# Altium schematic sheet TempAdc.SchDoc
size A4; DocumentNumber: 8; SheetNumber: 8; SheetTotal: 15
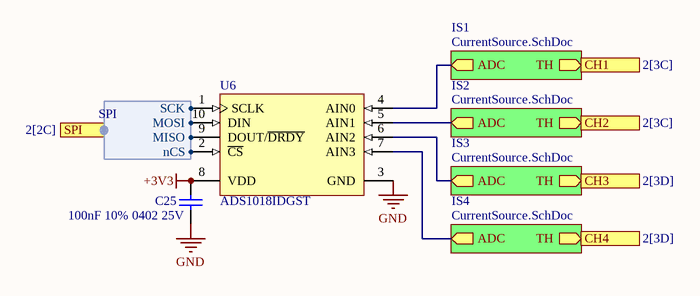
[diagram p0: TempAdc.SchDoc]

## Parts
C25  100nF 10% 0402 25V  [0402N]
U6  ADS1018IDGST  [TI-DGS10_N]

## Sub-sheets
IS1 = CurrentSource.SchDoc: TH (out), ADC (out)
IS2 = CurrentSource.SchDoc: TH (out), ADC (out)
IS3 = CurrentSource.SchDoc: TH (out), ADC (out)
IS4 = CurrentSource.SchDoc: TH (out), ADC (out)

## Ports
CH1 (out, see 2[3C]), CH2 (out, see 2[3C]), CH3 (out, see 2[3D]), CH4 (out, see 2[3D]), SPI (out, harness SPI, see 2[2C])

## Harnesses
SPI: nCS, SCK, MISO, MOSI

## Nets
+3V3: C25.2 U6.8(VDD)
GND: C25.1 U6.3(GND)
CH1: port CH1, sheet IS1/TH
CH2: port CH2, sheet IS2/TH
CH3: port CH3, sheet IS3/TH
CH4: port CH4, sheet IS4/TH
NetU6_1: U6.1(SCLK) ; port SPI.SCK
NetU6_2: U6.2(~{CS}) ; port SPI.nCS
NetU6_4: U6.4(AIN0) ; sheet IS1/ADC
NetU6_5: U6.5(AIN1) ; sheet IS2/ADC
NetU6_6: U6.6(AIN2) ; sheet IS3/ADC
NetU6_7: U6.7(AIN3) ; sheet IS4/ADC
NetU6_9: U6.9(DOUT/~{DRDY}) ; port SPI.MISO
NetU6_10: U6.10(DIN) ; port SPI.MOSI

## Library data of the parts
C25 = C0402: Capacitance: 100n; Tolerance: 10; Voltage: 25; Footprint: 0402
U6 = CMP-0003-00370-2: 12-Bit ADC with Integrated MUX, PGA, Temperature Sensor, Oscillator and Reference, -40 to 125 degC, 10-pin SOP (DGS10), Green (RoHS & no Sb/Br); Manufacturer: Texas Instruments; SubFamily: Precision ADC (<=10MSPS); Digital Supply(Min)(V): 2; INL(Max)(+/-LSB): 0.5; Digital Supply(Max)(V): 5.5; # Input Channels: 4; Architecture: Delta-Sigma; Sample Rate(max)(SPS): 3.3k; Resolution(Bits): 12; Interface: Serial SPI; ComponentLink2URL: http://www.ti.com/lit/ds/symlink/ads1018.pdf; DatasheetVersion: SBAS526A; PackageVersion: 4073272/C, 02/2004; Mounting Technology: Surface Mount; ComponentLink2Description: Datasheet; Eco-Plan: Green (RoHS & no Sb/Br); ComponentLink1Description: Manufacturer URL; PackageReference: DGS10; Code_JEDEC: MO-153; ComponentLink1URL: http://www.ti.com/; Analog Voltage AV/DD(Min)(V): 2; Analog Voltage AV/DD(Max)(V): 5.5; ComponentLink3Description: Package Specification; ComponentLink3URL: http://www.ti.com/lit/ml/mpds035b/mpds035b.pdf; PartNumber: ADS1018IDGST; PackageDescription: 10-Pin Plastic Small Outline, Body 3 x 3 mm, Pitch 0.5 mm